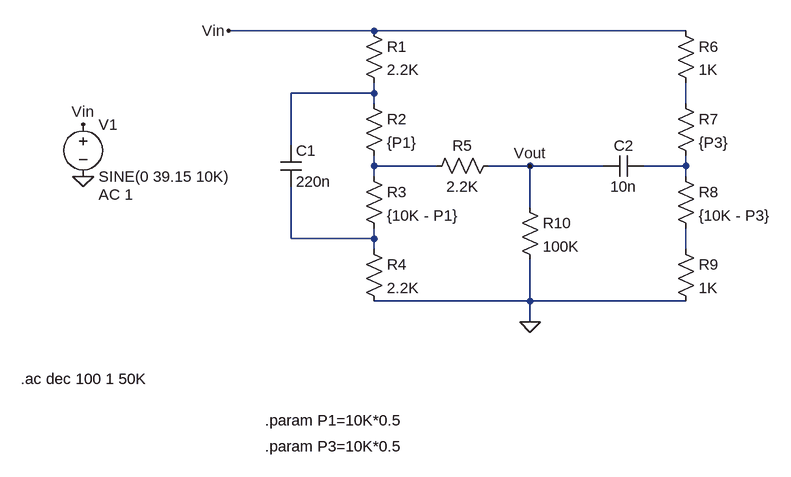
[diagram p0: schematic filterCircuit.asc]
filterCircuit.asc, the LTspice schematic file:
Version 4.1
SHEET 1 880 760
WIRE 96 80 -128 80
WIRE 576 80 96 80
WIRE 96 176 96 160
WIRE 96 176 -32 176
WIRE 96 192 96 176
WIRE 576 192 576 160
WIRE -32 256 -32 176
WIRE 96 288 96 272
WIRE 192 288 96 288
WIRE 336 288 272 288
WIRE 448 288 336 288
WIRE 576 288 576 272
WIRE 576 288 512 288
WIRE 96 304 96 288
WIRE 576 304 576 288
WIRE 336 352 336 288
WIRE -32 400 -32 320
WIRE 96 400 96 384
WIRE 96 400 -32 400
WIRE 96 416 96 400
WIRE 576 416 576 384
WIRE 336 496 336 432
WIRE 336 496 96 496
WIRE 576 496 336 496
WIRE 336 528 336 496
FLAG -128 80 Vin
FLAG 336 528 0
FLAG 336 288 Vout
FLAG -352 304 0
FLAG -352 224 Vin
SYMBOL res 80 64 R0
SYMATTR InstName R1
SYMATTR Value 2.2K
SYMBOL res 80 176 R0
SYMATTR InstName R2
SYMATTR Value {P1}
SYMBOL res 80 288 R0
SYMATTR InstName R3
SYMATTR Value {10K - P1}
SYMBOL res 80 400 R0
SYMATTR InstName R4
SYMATTR Value 2.2K
SYMBOL res 288 272 R90
WINDOW 0 0 56 VBottom 2
WINDOW 3 32 56 VTop 2
SYMATTR InstName R5
SYMATTR Value 2.2K
SYMBOL cap 512 272 R90
WINDOW 0 0 32 VBottom 2
WINDOW 3 32 32 VTop 2
SYMATTR InstName C2
SYMATTR Value 10n
SYMBOL res 560 64 R0
SYMATTR InstName R6
SYMATTR Value 1K
SYMBOL res 560 176 R0
SYMATTR InstName R7
SYMATTR Value {P3}
SYMBOL res 560 288 R0
SYMATTR InstName R8
SYMATTR Value {10K - P3}
SYMBOL res 560 400 R0
SYMATTR InstName R9
SYMATTR Value 1K
SYMBOL res 320 336 R0
SYMATTR InstName R10
SYMATTR Value 100K
SYMBOL voltage -352 208 R0
WINDOW 123 24 124 Left 2
WINDOW 39 0 0 Left 0
SYMATTR Value2 AC 1
SYMATTR InstName V1
SYMATTR Value SINE(0 39.15 10K)
SYMBOL cap -48 256 R0
SYMATTR InstName C1
SYMATTR Value 220n
TEXT -72 680 Left 2 !.param P1=10K*0.5
TEXT -72 720 Left 2 !.param P3=10K*0.5
TEXT -448 616 Left 2 !.ac dec 100 1 50K

The netlist it stands for:
* filterCircuit.asc
R1 Vin N001 2.2K
R2 N001 N003 {P1}
R3 N003 N005 {10K - P1}
R4 N005 0 2.2K
R5 Vout N003 2.2K
C2 N004 Vout 10n
R6 Vin N002 1K
R7 N002 N004 {P3}
R8 N004 N006 {10K - P3}
R9 N006 0 1K
R10 Vout 0 100K
V1 Vin 0 SINE(0 39.15 10K) AC 1
C1 N001 N005 220n
.param P1=10K*0.5
.param P3=10K*0.5
.ac dec 100 1 50K
.backanno
.end